# EAGLE board MagicShifter (EAGLE 5.11)
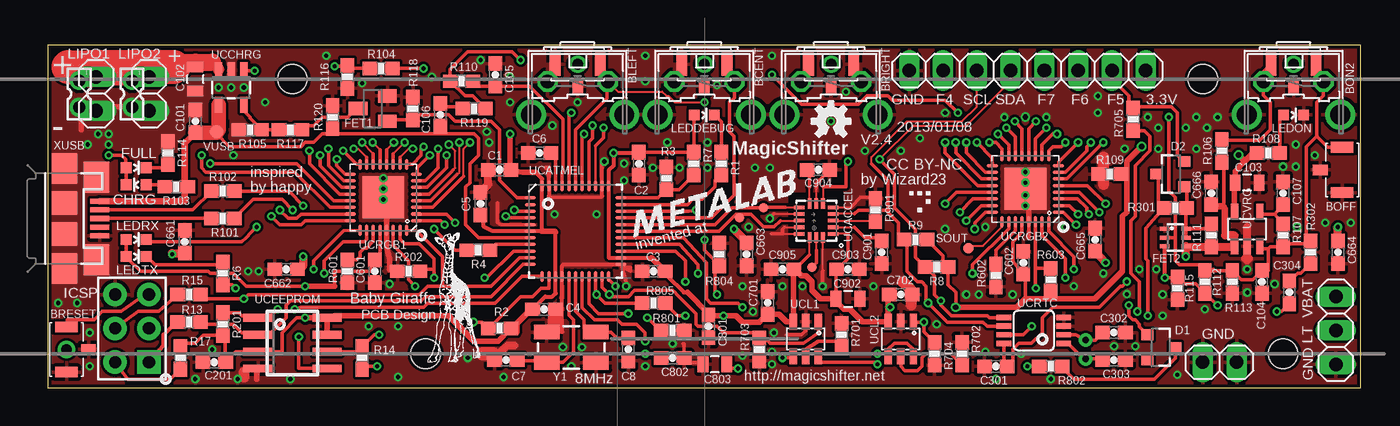
[diagram p1: board, top side]
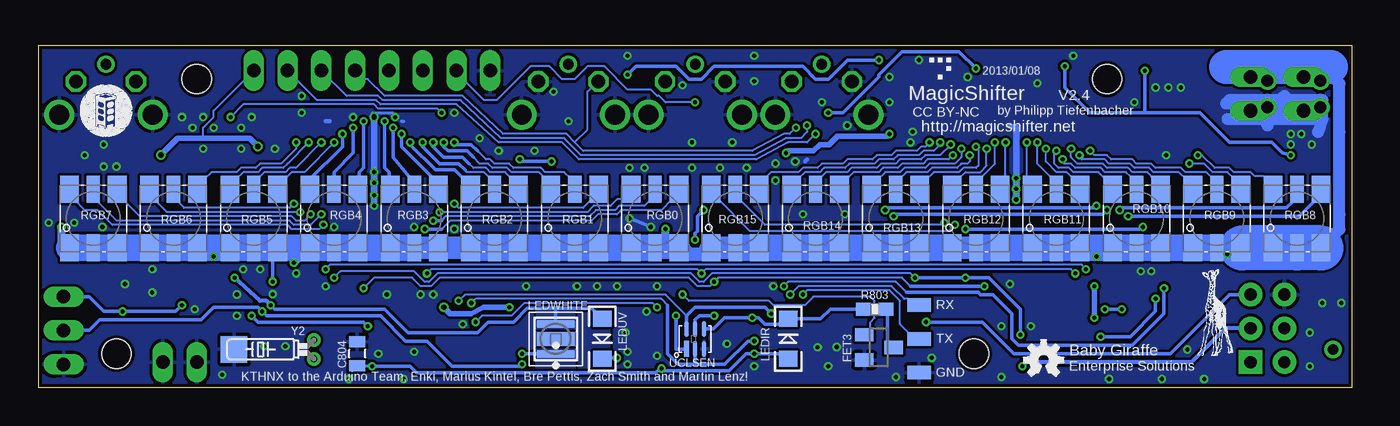
[diagram p2: board, bottom side, seen from below]

Size 98.72 x 25.7 mm. Coordinates in mm from the lower left corner, seen from the top.
Outline: 0,0 98.72,0 98.72,25.7 0,25.7 0,0
Copper layers (1*16): Top 0.035mm / dielectric 1.5mm / Bottom 0.035mm
Design rules "Fusion_eagle_rule_v1.1 *": minimum track width 6mil, minimum drill 12mil, track to track 6mil, track to pad 6mil, pad to pad 6mil, via to via 6mil, smd to smd 0mil, copper to edge 10mil, drill to drill 10mil, minimum pad ring 10mil, minimum via ring 6mil, stop-mask expansion 2mil, vias tented up to drill 100mil, thermal gap 10mil
Net classes: 0 default: width 0.152 mm
Holes 2.2 mm at 92.87,2.54 86.84,23.18 18.41,23.18 28.42,2.54
tRestrict: area 55.9,10.6 to 59.7,14.4

## Footprints (pad centres in the part's own frame; a part is rotated, then mirrored left to right if it is on the bottom)
B3F-31XX = drill 1.016 octagon: 1 -2.261,-1.245; 2 2.261,-1.245 | drill 1.499 pad 2.159 round: 3 -3.505,1.245; 4 3.505,1.245
B3U-1100P-B = smd 0.8 x 1.7: P$1 -1.7,0; P$2 1.7,0 | smd 0.8 x 1.1: P$3 0,-1.65 | drill 0.8 round: P$4 0,0
B3U-1100P = smd 0.8 x 1.7: P$1 -1.7,0; P$2 1.7,0 | smd 0.8 x 1.1: P$3 0,-1.65
0603-CAP = smd 1.1 x 1: 1 -0.85,0; 2 0.85,0
0805 = smd 0.8 x 1.2: 1 -0.9,0; 2 0.9,0
LED-0603 = smd 0.8 x 0.8: A 0,-0.75; C 0,0.75
SOT23-3 = smd 0.8 x 0.9: 1 -0.95,-1; 2 0.95,-1; 3 0,1.1
SOT23 = smd 1 x 1.4: 1 -0.95,-1.1; 2 0.95,-1.1; 3 0,1.1
SOT363_INFINEON = smd 0.3 x 0.7: 1 -0.65,-0.8; 2 0,-0.8; 3 0.65,-0.8; 4 0.65,0.8; 5 0,0.8; 6 -0.65,0.8
HEAD3X2 = drill 0.914 pad 1.778 square: 1 0,0 | drill 0.914 pad 1.778 round: 2 0,2.54; 3 2.54,0; 4 2.54,2.54; 5 5.08,0; 6 5.08,2.54
TP07R = smd 0.7 x 0.7: TP 0,0
1X02 = drill 1.016 long: 1 -1.27,0; 2 1.27,0
1X03 = drill 1.016 long: 1 -2.54,0; 2 0,0; 3 2.54,0
1X08 = drill 1.016 long: 1 -8.89,0; 2 -6.35,0; 3 -3.81,0; 4 -1.27,0; 5 1.27,0; 6 3.81,0; 7 6.35,0; 8 8.89,0
1X03SMD/90 = smd 1.016 x 1.778: 1 -2.54,0; 2 0,0; 3 2.54,0
LED-1206 = smd 1.2 x 1.4: A -1.5,0; C 1.5,0
OSLON = smd 2.8 x 0.55: A 0,1.125; K 0,-1.125 | smd 2.8 x 1: TP 0,0
0603-RES = smd 1.1 x 1: 1 -0.85,0; 2 0.85,0
LED-TRICOLOR-5050 = smd 2 x 1.4: 1 -2.2,1.8; 3 -2.2,-1.8; 4 2.2,-1.8; 6 2.2,1.8 | smd 2 x 1: 2 -2.2,0; 5 2.2,0
TP08R = smd 0.8 x 0.8: TP 0,0
QFN-16_0.5MM = smd 0.8 x 0.27: 1 -1.275,1; 2 -1.275,0.5; 3 -1.275,0; 4 -1.275,-0.5; 5 -1.275,-1; 9 1.275,-1; 10 1.275,-0.5; 11 1.275,0; 12 1.275,0.5; 13 1.275,1 | smd 0.27 x 0.8: 6 -0.5,-1.275; 7 0,-1.275; 8 0.5,-1.275; 14 0.5,1.275; 15 0,1.275; 16 -0.5,1.275
QFN-44-NOPAD = smd 0.82 x 0.27: 1 -3.4,2.5; 2 -3.4,2; 3 -3.4,1.5; 4 -3.4,1; 5 -3.4,0.5; 6 -3.4,0; 7 -3.4,-0.5; 8 -3.4,-1; 9 -3.4,-1.5; 10 -3.4,-2; 11 -3.4,-2.5; 23 3.4,-2.5; 24 3.4,-2; 25 3.4,-1.5; 26 3.4,-1; 27 3.4,-0.5; 28 3.4,0; 29 3.4,0.5; 30 3.4,1; 31 3.4,1.5; 32 3.4,2; 33 3.4,2.5 | smd 0.27 x 0.82: 12 -2.5,-3.4; 13 -2,-3.4; 14 -1.5,-3.4; 15 -1,-3.4; 16 -0.5,-3.4; 17 0,-3.4; 18 0.5,-3.4; 19 1,-3.4; 20 1.5,-3.4; 21 2,-3.4; 22 2.5,-3.4; 34 2.5,3.4; 35 2,3.4; 36 1.5,3.4; 37 1,3.4; 38 0.5,3.4; 39 0,3.4; 40 -0.5,3.4; 41 -1,3.4; 42 -1.5,3.4; 43 -2,3.4; 44 -2.5,3.4
SOT23-5 = smd 0.55 x 1.2: 1 -0.95,-1.3; 2 0,-1.3; 3 0.95,-1.3; 4 0.95,1.3; 5 -0.95,1.3
SO-08 = smd 0.6 x 2.2: 1 -1.905,-2.6; 2 -0.635,-2.6; 3 0.635,-2.6; 4 1.905,-2.6; 5 1.905,2.6; 6 0.635,2.6; 7 -0.635,2.6; 8 -1.905,2.6
SOT23-6 = smd 0.55 x 1.2: 1 -0.95,-1.3; 2 0,-1.3; 3 0.95,-1.3; 4 0.95,1.3; 5 0,1.3; 6 -0.95,1.3
TCS377X = smd 1.2 x 0.35: P$1 -0.75,0.65; P$2 -0.75,0; P$3 -0.75,-0.65; P$4 0.75,-0.65; P$5 0.75,0; P$6 0.75,0.65
QFN32_VSTOP = smd 0.27 x 0.85: 1 -1.75,-2.475; 2 -1.25,-2.475; 3 -0.75,-2.475; 4 -0.25,-2.475; 5 0.25,-2.475; 6 0.75,-2.475; 7 1.25,-2.475; 8 1.75,-2.475; 17 1.75,2.475; 18 1.25,2.475; 19 0.75,2.475; 20 0.25,2.475; 21 -0.25,2.475; 22 -0.75,2.475; 23 -1.25,2.475; 24 -1.75,2.475 | smd 0.85 x 0.27: 9 2.475,-1.75; 10 2.475,-1.25; 11 2.475,-0.75; 12 2.475,-0.25; 13 2.475,0.25; 14 2.475,0.75; 15 2.475,1.25; 16 2.475,1.75; 25 -2.475,1.75; 26 -2.475,1.25; 27 -2.475,0.75; 28 -2.475,0.25; 29 -2.475,-0.25; 30 -2.475,-0.75; 31 -2.475,-1.25; 32 -2.475,-1.75 | smd 3.15 x 3.15: EP 0,0
MSOP8 = smd 0.4 x 1.1: 1 -0.975,-2.25; 2 -0.325,-2.25; 3 0.325,-2.25; 4 0.975,-2.25; 5 0.975,2.25; 6 0.325,2.25; 7 -0.325,2.25; 8 -0.975,2.25
SOT25 = smd 0.55 x 1.2: 1 -0.95,-1.3; 2 0,-1.3; 3 0.95,-1.3; 4 0.95,1.3; 5 -0.95,1.3
TP10R = smd 1 x 1: TP 0,0
87758-0216 = drill 0.9 pad 1.27 round: 1 0,-1; 2 0,1
USB-MICROB = smd 0.38 x 1.4: D+ 0,2.65; D- -0.65,2.65; GND 1.3,2.65; ID 0.65,2.65; VBUS -1.3,2.65 | smd 2.3 x 1.9: MT1 -3.75,0; MT2 3.75,0; MT5 -3.1,2.4; MT6 3.1,2.4 | smd 1.775 x 1.9: MT3 -1.163,0; MT4 1.163,0
CRYSTAL-SMD-5X3 = smd 1.9 x 1.1: 1 -1.85,-1.15; 2 1.85,-1.15; 3 1.85,1.15; 4 -1.85,1.15
NC15LF = drill 0.5 round: 1 -0.7,-1.5; 2 0.7,-1.5 | smd 2 x 2: GND 0,4.5

## Placement (x,y rotation side)
BCENT  BUTTON  [B3F-31XX]  49.37,21.75 180 top
BCENT2  B3UBOSS  [B3U-1100P-B]  49.37,24.29 0 top
BLEFT  BUTTON  [B3F-31XX]  39.85,21.75 180 top
BLEFT2  B3UBOSS  [B3U-1100P-B]  39.85,24.29 0 top
BOFF  OFF  [B3U-1100P]  97.31,16.35 270 top
BON  BUTTON  [B3F-31XX]  93.66,21.75 180 top
BON2  ON  [B3U-1100P-B]  93.66,24.29 0 top
BRESET  B3UBOSS  [B3U-1100P-B]  1.43,2.86 90 top
BRIGHT  BUTTON  [B3F-31XX]  58.9,21.75 180 top
BRIGHT2  B3UBOSS  [B3U-1100P-B]  58.9,24.29 0 top
C1  0.1uF  [0603-CAP]  33.97,16.35 180 top
C2  0.1uF  [0603-CAP]  44.45,16.83 270 top
C3  0.1uF  [0603-CAP]  45.56,8.73 0 top
C4  0.1uF  [0603-CAP]  37.31,5.87 180 top
C5  1uF  [0603-CAP]  32.54,13.81 270 top
C6  1uF  [0603-CAP]  36.99,17.62 0 top
C7  22pF  [0603-CAP]  34.45,2.06 180 top
C8  22pF  [0603-CAP]  43.66,2.86 270 top
C101  1uF  [0603-CAP]  11.11,20 270 top
C102  2.2uF  [0805]  11.11,23.18 90 top
C103  2.2uF/10V/X7R  [0805]  90.17,15.4 180 top
C104  10n  [0603-CAP]  91.28,7.94 90 top
C105  10n  [0603-CAP]  33.66,23.5 270 top
C106  33n oder 47n  [0603-CAP]  29.53,20.48 90 top
C107  NF  [0603-CAP]  92.87,14.61 270 top
C201  0.1uF  [0603-CAP]  12.54,1.91 0 top
C301  0.1uF  [0603-CAP]  71.28,1.59 180 top
C302  NF  [0603-CAP]  80.17,4.13 0 top
C303  NF  [0603-CAP]  80.17,2.06 0 top
C304  33n oder 47n  [0603-CAP]  93.34,7.14 90 top
C601  0.1uF  [0603-CAP]  24.61,8.73 90 top
C602  0.1uF  [0603-CAP]  73.34,9.37 270 top
C661  1uF  [0603-CAP]  10.32,10.95 90 top
C662  1uF  [0603-CAP]  17.94,8.89 180 top
C663  1uF  [0603-CAP]  52.55,10 270 top
C664  1uF  [0603-CAP]  97,10.16 270 top
C665  1uF  [0603-CAP]  78.74,11.11 90 top
C666  1uF  [0603-CAP]  87.47,14.61 90 top
C701  1uF  [0603-CAP]  54.13,6.35 90 top
C702  1uF  [0603-CAP]  64.14,6.99 0 top
C801  1uF  [0603-CAP]  49.69,4.6 270 top
C802  1uF  [0603-CAP]  46.99,2.22 0 top
C803  22uF  [0805]  50.16,1.75 180 top
C804  NF  [0805]  74.77,2.54 90 bottom
C901  0.1uF  [0603-CAP]  62.71,10.16 270 top
C902  4.7uF  [0805]  60.17,6.67 0 top
C903  0.1uF  [0603-CAP]  60.17,8.89 0 top
C904  0.1uF  [0603-CAP]  57.94,16.35 0 top
C905  0.1uF  [0603-CAP]  55.25,8.89 0 top
CHRG  Blue  [LED-0603]  6.67,15.24 90 top
D1  [SOT23-3]  83.66,3.02 270 top
D2  [SOT23-3]  84.45,16.03 90 top
FET1  BSS123  [SOT23]  24.45,20.95 90 top
FET2  NX3008CBKS  [SOT363_INFINEON]  84.77,11.27 270 top
FET3  BSS123  [SOT23]  35.56,3.02 270 bottom
FULL  Green  [LED-0603]  6.67,16.51 270 top
ICSP  HEAD3X2  [HEAD3X2]  7.62,1.91 90 top
INT1  TPTP07R  [TP07R]  52,12.75 0 top
INT2  TPTP07R  [TP07R]  53.82,13.49 0 top
JP_GND  [1X02]  88.11,1.91 180 top
JP_LTEST  [1X03]  96.84,4.29 270 top
JP_PINS  [1X08]  73.66,23.81 180 top
JP_SERIAL  [1X03SMD/90]  32.54,3.65 270 bottom
LEDDEBUG  Blue  [LED-0603]  49.37,20.48 270 top
LEDIR  IR  [LED-1206]  42.39,3.65 90 bottom
LEDON  Red  [LED-0603]  93.66,20.48 270 top
LEDRX  Green  [LED-0603]  6.67,11.11 270 top
LEDTX  Red  [LED-0603]  6.67,9.84 270 top
LEDUV  UV  [LED-1206]  56.36,3.65 270 bottom
LEDWHITE  OSLON  [OSLON]  59.85,3.65 0 bottom
LIPO1  [1X02]  3.65,22.07 270 top
LIPO2  [1X02]  7.62,22.07 270 top
R1  1K  [0603-RES]  50.64,16.83 270 top
R2  10K  [0603-RES]  33.97,4.44 0 top
R3  10K  [0603-RES]  46.51,15.72 270 top
R4  1K  [0603-RES]  32.38,10.32 0 top
R6  1K  [0603-RES]  13.18,8.57 270 top
R7  NF  [0603-RES]  48.58,16.83 270 top
R8  4.7K  [0603-RES]  66.83,9.05 0 top
R9  4.7K  [0603-RES]  65.25,11.11 0 top
R13  330R  [0603-RES]  10.64,4.92 180 top
R14  330R  [0603-RES]  23.65,2.22 270 top
R15  330R  [0603-RES]  10.64,6.98 180 top
R17  NF  [0603-RES]  10,2.22 270 top
R101  22R  [0603-RES]  13.18,12.7 180 top
R102  22R  [0603-RES]  13.18,14.76 180 top
R103  1K  [0603-RES]  9.68,15.08 180 top
R104  47K  [0603-RES]  25.08,23.97 180 top
R105  4.7K  [0603-RES]  15.24,19.37 180 top
R106  10K  [0603-RES]  88.27,17.78 270 top
R107  22K  [0603-RES]  92.87,11.43 90 top
R108  1K  [0603-RES]  91.76,17.62 180 top
R109  NF  [0603-RES]  79.85,16.03 180 top
R110  22K  [0603-RES]  31.11,23.02 0 top
R111  100K  [0603-RES]  87.47,11.43 90 top
R112  330K  [0603-RES]  87,7.94 90 top
R113  560K  [0603-RES]  89.06,7.94 90 top
R114  1K  [0603-RES]  9.05,17.62 90 top
R115  NF  [0603-RES]  84.93,7.46 270 top
R116  100K  [0603-RES]  22.54,23.34 270 top
R117  RTCHRG  [0603-RES]  18.26,19.37 180 top
R118  100k  [0603-RES]  27.46,20.95 270 top
R119  1K  [0603-RES]  32.07,20.95 0 top
R120  100K  [0603-RES]  21.43,20.32 270 top
R201  100K  [0603-RES]  13.18,4.76 270 top
R202  100K  [0603-RES]  27.15,8.73 0 top
R301  NF  [0603-RES]  84.77,13.49 180 top
R302  1K  [0603-RES]  94.93,10.16 90 top
R601  REF1  [0603-RES]  22.54,8.73 90 top
R602  REF2  [0603-RES]  71.28,8.41 90 top
R603  100K  [0603-RES]  75.41,8.1 270 top
R701  REFUV  [0603-RES]  59.69,3.97 270 top
R702  REFWHITE  [0603-RES]  68.74,2.54 270 top
R703  10K  [0603-RES]  53.5,2.86 270 top
R704  10K  [0603-RES]  66.67,2.54 270 top
R705  10K  [0603-RES]  81.6,20.16 90 top
R801  1M  [0603-RES]  46.99,4.29 180 top
R802  22R  [0603-RES]  75.41,1.59 0 top
R803  47R 100mW  [0603-RES]  35.88,5.87 180 bottom
R804  100k  [0603-RES]  50.48,10 270 top
R805  1K  [0603-RES]  45.56,6.35 0 top
R901  0R  [0603-RES]  62.23,13.34 270 top
RGB0  LED-TRICOLOR-5050  [LED-TRICOLOR-5050]  52.39,12.7 90 bottom
RGB1  LED-TRICOLOR-5050  [LED-TRICOLOR-5050]  58.42,12.7 90 bottom
RGB2  LED-TRICOLOR-5050  [LED-TRICOLOR-5050]  64.45,12.7 90 bottom
RGB3  LED-TRICOLOR-5050  [LED-TRICOLOR-5050]  70.48,12.7 90 bottom
RGB4  LED-TRICOLOR-5050  [LED-TRICOLOR-5050]  76.52,12.7 90 bottom
RGB5  LED-TRICOLOR-5050  [LED-TRICOLOR-5050]  82.55,12.7 90 bottom
RGB6  LED-TRICOLOR-5050  [LED-TRICOLOR-5050]  88.58,12.7 90 bottom
RGB7  LED-TRICOLOR-5050  [LED-TRICOLOR-5050]  94.61,12.7 90 bottom
RGB8  LED-TRICOLOR-5050  [LED-TRICOLOR-5050]  4.13,12.7 90 bottom
RGB9  LED-TRICOLOR-5050  [LED-TRICOLOR-5050]  10.16,12.7 90 bottom
RGB10  LED-TRICOLOR-5050  [LED-TRICOLOR-5050]  16.19,12.7 90 bottom
RGB11  LED-TRICOLOR-5050  [LED-TRICOLOR-5050]  22.23,12.7 90 bottom
RGB12  LED-TRICOLOR-5050  [LED-TRICOLOR-5050]  28.26,12.7 90 bottom
RGB13  LED-TRICOLOR-5050  [LED-TRICOLOR-5050]  34.29,12.7 90 bottom
RGB14  LED-TRICOLOR-5050  [LED-TRICOLOR-5050]  40.32,12.7 90 bottom
RGB15  LED-TRICOLOR-5050  [LED-TRICOLOR-5050]  46.35,12.7 90 bottom
SOUT  TPTP08R  [TP08R]  69.22,10.48 0 top
TNC  TPTP07R  [TP07R]  57.47,9.05 0 top
U$1  OSHW-LOGOS  [OSHW-LOGO-S]  23.18,2.06 0 bottom
U$2  METALAB  [METALAB]  43.5,10.95 0 top
U$3  OSHW-LOGOS  [OSHW-LOGO-S]  58.9,20 0 top
U$4  [BABY_GIRAFFE_1.5]  28.57,1.91 0 top
U$5  [BABY_GIRAFFE]  11.59,2.38 0 bottom
U$6  [METALAB_SMALL]  93.66,20.8 0 bottom
UCACCEL  FXOS8700CQ  [QFN-16_0.5MM]  57.78,12.54 180 top
UCATMEL  ATMEGA32U4QFN2  [QFN-44-NOPAD]  39.69,11.75 0 top
UCCHRG  MCP73831  [SOT23-5]  13.81,22.54 180 top
UCEEPROM  25AA080SN  [SO-08]  18.41,3.33 270 top
UCL1  AHK3292  [SOT23-6]  56.99,3.65 180 top
UCL2  AHK3292  [SOT23-6]  64.14,3.65 180 top
UCLSEN  TCS377X  [TCS377X]  49.37,3.65 90 bottom
UCRGB1  TLC5947  [QFN32_VSTOP]  25.24,14.29 90 top
UCRGB2  TLC5947  [QFN32_VSTOP]  73.5,14.92 90 top
UCRTC  MCP7941XMSOP8  [MSOP8]  74.14,4.29 90 top
UCVRG  MCP182433  [SOT25]  90.17,11.91 0 top
VUSB  TPTP10R  [TP10R]  12.7,19.21 90 top
X2  87758-0216  [87758-0216]  6.35,22.07 180 top
X3  87758-0216  [87758-0216]  2.38,22.07 180 top
XUSB  USB-MICROB  [USB-MICROB]  1.27,12.7 270 top
Y1  8MHz  [CRYSTAL-SMD-5X3]  39.37,3.02 0 top
Y2  [NC15LF]  79.53,2.86 90 bottom

## Tracks (layer width: path | path; a pad name or v marks a point on that pad's centre or on a via)
+3V3  (via drill 0.31, 0.4)
  Top 0.16: R17.2 R17.1 | 60.17,11.54 UCACCEL.1 | 57.28,9.98 UCACCEL.14
  Top 0.254: 24.99,9.53 24.99,9.2 24.75,9.2 | 24.99,9.53 UCRGB1.28 | 32.78,12.09 32.85,12.09 | 21.59,7.62 21.59,8.73 24.29,8.73 24.29,9.58 C601.2 24.93,9.58 24.99,9.53 | 37.15,11.75 37.19,11.79 | 42.19,9.79 42.23,9.75 | UCRGB2.28 73.25,11.66 72.55,10.95 72.55,9.47 C602.2 | R17.2 9.84,1.27 9.21,0.64 6.03,0.64 ICSP.2 | R17.1 10.1,3.33 11.11,3.33 11.69,3.91 R201.2 13.34,3.81 13.34,2.12 13.49,1.96 C201.2 13.07,2.22 13.65,2.22 14.13,2.7 UCEEPROM.3 17.62,2.7 17.62,4.13 18.73,5.24 v19.37,5.24 | C602.2 73.47,8.68 73.44,8.65 | LEDRX.A LEDTX.A 5.92,9.8 6.99,8.73 12.06,8.73 12.22,8.57 13.97,8.57 14.92,7.62 v19.37,7.62 | 60.17,11.54 60.17,9.68 59.37,8.89 C903.1 59.27,8.84 C902.1 | C103.2 89.22,15.19 | UCL1.3 56.07,5.08 | C902.1 59.11,7.14 | 63.19,6.73 C702.1 | C902.1 59.27,6.46 | 46.51,8.41 C3.2 46.57,8.41 | 63.19,6.03 v63.34,6.02 | 44.39,17.62 C2.1 R7.1 48.58,20.43 LEDDEBUG.A | 54.03,5.4 C701.1 | 56.2,8.89 57.28,9.98 | 55.78,8.89 C905.2 56.2,8.89 | 56.2,8.89 | v68.26,6.03 68.26,7.14 67.68,7.72 R8.2 67.68,9.15 67.31,9.21 67.31,9.9 R9.2 | C602.2 73.34,8.57 73.5,8.41 73.5,6.67 | R603.2 75.41,6.67 75.09,6.67
  Top 0.305: 37.15,11.75 UCATMEL.6 33.44,11.75 32.78,12.09 32.78,13.36 C5.2 | 42.23,9.75 UCATMEL.24 45.4,9.75 | 38.19,11.66 UCATMEL.14 38.19,7.07 37.94,6.83 37.41,6.83 C4.2 36.35,5.87 | 37.19,11.79 UCATMEL.44 37.19,15.68 36.67,16.19 | 42.19,9.79 UCATMEL.34 42.19,16.31 42.55,16.67 v42.55,17.62 44.39,17.62 | 48.1,7.14 47.84,7.14 46.57,8.41
  Top 0.406: 37.15,11.75 38.1,11.75 38.19,11.66 | v19.37,7.62 21.59,7.62 | v19.37,5.24 UCEEPROM.8 | UCEEPROM.8 21.59,5.24 21.43,5.24 | 34.82,16.3 34.82,16.25 34.77,16.35 v34.77,19.05 | 36.67,16.19 35.72,16.19 34.82,16.3 | 34.82,16.3 C1.1 | UCEEPROM.8 UCEEPROM.7 | 21.43,5.24 | 21.43,5.24 21.59,5.4 28.26,5.4 28.42,5.4 28.73,5.4 30.16,5.4 32.07,3.49 33.87,3.49 R2.2 35.24,4.13 35.3,4.18 35.3,4.82 36.35,5.87 | 89.22,15.19 UCVRG.5 | 63.19,6.73 63.19,6.03 UCL2.3 61.25,4.95 60.33,5.87 59.85,5.87 59.27,6.46 | 45.4,9.75 C3.2 | v68.26,6.03 71.75,6.03 72.87,6.03 73.5,6.67 | 73.5,6.67 73.34,6.51 | 73.5,6.67 75.09,6.67 78.74,6.67 80.8,8.73 80.8,12.86 81.12,13.18 81.12,15.88 | 54.03,5.4 53.66,5.08 53.5,4.92 52.23,4.92 51.75,5.4 v50.8,5.4 49.69,5.4 C801.1 49.69,5.56 48.1,7.14 | 56.2,8.89 56.67,8.41 56.99,8.41 57.47,7.94 57.47,7.3 58.1,6.67 C902.1 | C701.1 54.98,5.5 55.53,4.95 UCL1.3 | 56.07,5.08 56.07,8.87 C905.2 | v89.53,17.46 90.01,16.99 | 90.91,17.57 R108.2 90.65,17.62 90.01,16.99 | C103.2 89.27,16.25 90.01,16.99 | 90.01,16.99 | 81.12,15.88 81.12,16.99 v82.23,18.1 | R109.1 80.86,15.88 81.12,15.88
  Bottom 0.16: JP_PINS.1 | JP_PINS.1 85.57,20.8 85.57,20.32 86.36,19.53 86.36,18.73
  Bottom 0.254: UCLSEN.P$1 50.06,2.86 50.8,2.86 v50.8,5.4
  Bottom 0.406: v19.37,5.24 v19.37,7.62 | v34.77,19.05 34.92,18.89 38.68,18.89 39.31,18.26 40.01,18.26 40.48,17.78 42.39,17.78 v42.55,17.62 | v82.23,18.1 82.87,18.73 86.36,18.73 88.27,18.73 v89.53,17.46 | v68.26,6.03 67.79,5.56 66.2,5.56 65.26,6.02 v63.34,6.02
A1  (via drill 0.31)
  Top 0.254: UCATMEL.37 40.69,18.46 40.96,18.73 v40.96,19.68
  Bottom 0.16: JP_PINS.3 75.56,21.91 73.18,21.91 72.87,21.59 66.99,21.59 63.98,18.73 59.21,18.73 57.94,17.46 44.93,17.46 42.55,18.73 41.43,18.73 40.96,19.21 v40.96,19.68
AREF
  Top 0.254: UCATMEL.42 38.19,17.27 C6.2
BLANK  (via drill 0.31, 0.31 pad 0.3)
  Top 0.254: v27.62,7.62 27.15,8.1 27.15,9.53 25.99,10.68 UCRGB1.30 | v47.94,7.94 47.94,9.53 47.22,10.25 UCATMEL.25 | 74.25,8.89 74.25,7.5 v74.3,7.46 | 74.25,8.89 UCRGB2.30 | R603.1 74.31,8.95 74.25,8.89
  Bottom 0.16: v74.3,7.46 73.5,8.26 70.64,8.26 70.01,7.62 69.22,7.62 68.58,8.26 49.85,8.26 49.21,7.62 48.26,7.62 v47.94,7.94 47.62,8.26 33.81,8.26 33.18,7.62
  Bottom 0.254: v27.62,7.62 33.18,7.62
BTNC
  Top 0.254: BCENT2.P$2 51.39,23.55 BCENT.1 51.63,21.79 51.28,21.43 51.28,19.21 51.59,18.89 51.59,14.45 49.9,12.75 UCATMEL.30
BTNL  (via drill 0.31)
  Top 0.16: BLEFT.1 42.88,22.23 46.2,22.23 46.51,21.91 46.67,21.91 47.15,21.43 v49.37,21.43
  Top 0.254: BLEFT2.P$2 41.86,23.55 BLEFT.1 42.07,22.95 42.07,21.75 39.69,19.37 UCATMEL.39
  Bottom 0.16: v49.37,21.43 51.59,21.43 52.07,21.91 52.23,21.91 52.7,22.38 54.45,22.38 56.2,24.13 57.47,24.13 58.42,23.18 59.37,23.18 60.33,24.13 61.75,24.13 64.29,21.59 65.25,21.59 67.31,23.65 JP_PINS.7
BTNR  (via drill 0.31)
  Top 0.2: UCATMEL.36 41.19,18.17
  Top 0.254: BRIGHT2.P$1 56.88,23.55 BRIGHT.2 | 41.19,18.17 | v41.8,19.53 41.8,18.78 41.19,18.17
  Bottom 0.16: 58.42,18.41 57.78,17.78 45.09,17.78 42.7,19.05 42.28,19.05 v41.8,19.53 | 58.42,18.41 59.05,19.05 63.82,19.05 66.83,21.91 72.71,21.91 73.98,23.18 74.3,23.18 JP_PINS.4 | BRIGHT.2 56.7,22.99 57.47,22.23 57.47,19.37 58.42,18.41
CS_EEPROM  (via drill 0.31)
  Top 0.254: v17.3,5.87 16.67,5.24 UCEEPROM.1 15.5,5.4 14.61,5.4 14.39,5.61 R201.1 | v18.57,5.87 19.05,6.03 28.26,6.03 28.57,6.35 33.66,6.35 33.81,6.51 35.65,8.35 UCATMEL.12
  Bottom 0.254: v17.3,5.87 v18.57,5.87
D+  (via drill 0.31)
  Top 0.254: UCATMEL.4 34.56,12.75 v34.45,12.86 | 17.62,14.13 | 17.62,14.13 v18.41,13.34 | R101.1 15.46,14.13 17.62,14.13
  Bottom 0.254: v34.45,12.86 34.29,13.02 18.73,13.02 v18.41,13.34
D-  (via drill 0.31)
  Top 0.254: UCATMEL.3 35.17,13.25 v35.08,13.34 | R102.1 18.15,14.76 v19.21,13.65
  Bottom 0.254: v35.08,13.34 34.92,13.49 19.37,13.49 v19.21,13.65
DEBUG_LED
  Top 0.254: UCATMEL.32 48.11,13.75 48.49,14.13 49.21,14.13 50.16,15.08 50.16,15.56 50.64,15.96 R1.2
GND  (via drill 0.31, 0.31 pad 0.3, 0.4 pad 0.3)
  Top 0.16: 54.59,13.04 UCACCEL.10 | 58.28,8.76 UCACCEL.16 | 55.24,11.54 UCACCEL.13 | 55.38,12.04 UCACCEL.12 | UCACCEL.7 57.78,15.03 | UCACCEL.5 60.37,13.54
  Top 0.254: 38.69,9.16 38.77,9.25 | 38.69,4.18 C4.1 38.1,5.87 | UCATMEL.5 34.11,12.25 33.81,12.38 33.81,13.87 | 41.69,14.38 41.59,14.29 37.78,14.29 | BLEFT.2 BLEFT2.P$1 | UCRGB2.29 73.75,11.26 | 47.78,3.28 47.84,3.28 C802.2 | v54.29,12.7 54.59,13.04 | 58.28,8.76 58.26,8.73 v58.26,7.62 | 54.4,11.54 55.24,11.54 55.24,11.91 55.38,12.04 | 55.56,3.97 56.67,3.97 56.99,4.29 | 60.37,13.54 61.12,14.29 62.13,14.29 R901.1 | 57.78,15.03 57.78,15.34 C904.2 | 43.5,7.94 | 43.18,9.05 43.5,7.94 | 43.18,9.05 43.81,9.05 43.81,8.73 43.18,9.05 | v14.29,0.64 14.61,0.64 14.76,0.79
  Top 0.305: 38.77,9.25 UCATMEL.23 | 38.69,9.16 UCATMEL.15 38.69,4.18 | 41.69,14.38 UCATMEL.35 41.69,17.05 41.91,17.14 | 37.78,14.29 37.69,14.38 UCATMEL.43 37.69,16.51 | 56.99,4.29 56.99,5.08 | 47.78,2.22 47.78,2.06 47.94,1.91 49.21,1.91
  Top 0.35: 37.69,16.51 37.47,16.51
  Top 0.406: 25.72,8.83 25.72,9.68 25.49,10.54 UCRGB1.29 25.49,14.36 | UCRGB2.29 73.75,14.51 73.5,13.49 | 8.73,21.11 2.22,21.11 2.54,20.8 2.54,19.37 | 15.72,0.64 15.72,1.27
  Top 0.5: 25.49,14.36 25.24,15.4
  Top 0.61: 90.17,12.06 UCVRG.2 90.17,9.84 | C5.1 33.12,15.24 C1.2 | 90.17,9.84 90.17,9.53 | 90.17,9.84 90.01,9.68 90.33,9.68 | 35.08,3.17 34.61,3.17 33.5,2.22 33.5,2.54
  Top 0.813: 64.29,7.94 64.93,7.3 64.93,6.19 | 79.38,17.3 79.38,15.24 | 14.76,0.79 14.76,1.11 | 38.1,4.31
  Top 1: 38.1,4.31 38.1,5.87
  Top 1.016: 32.7,2.54 33.5,2.54
  Bottom 0.24: 72.07,20.6 73.66,20.6
  Bottom 0.254: v52.7,12.06 v54.29,12.7 | 71.28,20 71.44,20
  Bottom 0.305: 40.96,17.14 41.12,16.99
  Bottom 0.35: 76.83,20 77.15,20
  Bottom 0.406: 25.24,19.53 25.72,19.68
  Bottom 0.5: v25.24,14.13 25.24,19.53 | v73.5,13.65 v73.5,20.32
  Bottom 0.9: 2.22,20.16 9.37,20.16 | 2.22,20.16 2.22,21.11 | 2.22,20.16 2.54,19.21 | 3.49,21.59 4.76,21.59 5.08,21.91 5.48,21.51 9.45,21.35 | 2.22,20.16 9.45,21.35 | 9.45,21.35 2.22,21.59 9.21,21.59 | 6.35,19.68 6.43,21.19
  other vias: 43.34,16.83 38.73,3.04 39.37,1.59 25.72,7.78 25.24,14.92 73.5,14.45 73.5,15.4 3.17,1.59 15.08,8.73 37.94,19.68 38.1,13.02 41.27,13.02 47.5,16.51 43.34,15.56 93.82,16.6 69.06,6.99 92.87,16.6 53.18,16.51 71.91,20.32 0.79,6.35 11.11,0.64 18.26,0.64 34.29,0.79 40.16,3.02 73.5,16.19 25.24,15.72 14.76,22.54 26.35,4.6 90.17,8.89 43.5,7.62 62.07,7.62 54.45,1.75 83.82,6.98 83.34,8.89 56.75,7.62 52.23,2.38 55.24,7.62 54.61,4.13 52.23,7.62 72.55,6.99 46.99,3.28 45.5,16.51 33.18,18.42 33.02,19.21 61.44,17.78 64.14,17.78 95.25,17.46 93.82,18.26 34.77,21.43 67.47,11.91 85.57,19.53 83.5,19.53 87.15,19.53 93.92,12.07 75.09,20.32 67.47,20.64 82.71,20.32 78.95,21.91 79.38,8.57 76.52,12.07 70.48,12.07 13.81,22.54 32.54,24.61 65.56,18.73 70.01,6.99 70.48,2.7 84.93,0.95 87,5.87 28.89,23.34 2.22,6.35 12.38,2.86 78.95,20.64 86.36,20.32 87.95,20.32 41.85,16.99 44.93,1.59 66.83,4.76 97.95,12.38 31.59,2.22 26.35,0.79 53.02,5.72 54.45,2.7 86.36,17.94 81.12,7.02 83.5,17.94 80.17,3.11 71.28,0.63 44.93,24.92 54.45,24.92 39.85,21.43 49.6,18.42 49.6,16.51 46.58,18.42 54.29,16.51 50.32,22.7 77.15,7.62 75.41,0.63 34.77,23.34 96.04,12.38 58.9,20 60.01,22.23 44.93,23.02 73.18,2.54 80.96,17.94 82.07,8.89 90.17,7.14 3.18,4.13 92.23,7.78 4.6,18.26 4.6,19.05 3.81,19.05 12.86,22.54 23.65,22.86 24.13,4.6 15.87,8.73 13.97,17.46 83.82,5.4 81.76,3.11 16.35,21.43 20.96,24.92 3.02,18.26
  pour Top (isolate 0.2): 0,0 98.42,0 98.42,25.4 0,25.4
  pour Bottom (isolate 0.2, rank 3): 0,0 98.42,0 98.42,25.4 0,25.4
  pour Top (isolate 0.254, no thermals): -2.54,27.94 14.92,27.94 15.56,17.78 -2.54,17.78
HWB
  Top 0.254: UCATMEL.33 45.9,14.25 R3.2 47.47,14.87 R7.2
INT1
  Top 0.16: 55.09,12.54 UCACCEL.11
  Top 0.254: UCATMEL.28 50.48,11.75 51.75,13.02 | 51.75,13.02 52.86,13.02 53.82,12.06 54.61,12.06 55.09,12.54 | 51.75,13.02 51.75,13 INT1.TP
INT2
  Top 0.16: 55.45,13.54 UCACCEL.9
  Top 0.254: UCATMEL.29 50.19,12.25 51.44,13.49 INT2.TP 53.7,13.54 55.45,13.54
INT3  (via drill 0.31)
  Top 0.254: R805.1 41.91,6.35 v41.27,6.99 41.19,7.07 UCATMEL.20
  Bottom 0.16: v41.27,6.99 40.96,7.3 34.77,7.3 33.97,6.51 33.97,4.76 33.18,3.97 32.7,3.65 JP_SERIAL.2
INTRTC  (via drill 0.31)
  Top 0.254: UCATMEL.38 40.19,18.91 v40.32,19.05 | JP_PINS.2 80.01,23.18 81.28,21.91 81.28,21.01 R705.2 81.5,21.11 84.45,21.11 84.93,20.64 84.93,17.46 85.57,16.82 D2.2
  Bottom 0.16: JP_PINS.2 77.79,21.59 73.34,21.59 73.03,21.27 67.31,21.27 64.14,18.41 59.37,18.41 58.1,17.14 44.77,17.14 42.39,18.41 40.96,18.41 v40.32,19.05
LED_ENA  (via drill 0.31)
  Top 0.254: UCL1.1 57.94,4.12 56.83,3.33 54.29,3.33 53.5,4.13 | 53.5,4.13 53.02,4.13 52.7,4.13 52.39,4.13 50.8,4.13 50.32,4.6 48.9,4.6 48.74,4.76 48.74,5.56 47.78,6.51 | 47.78,6.51 47.31,6.99 47.15,7.14 46.99,7.3 44.13,7.3 43.66,6.83 42.39,6.83 v42.23,6.99 41.69,7.53 UCATMEL.21 | 47.78,6.51 | 53.5,4.13 R703.1
  Bottom 0.16: v42.23,6.99 41.59,7.62 34.61,7.62 33.66,6.67 33.34,6.67 32.86,6.19 JP_SERIAL.1
LED_ENB  (via drill 0.31)
  Top 0.254: UCATMEL.27 47.81,11.25 49.53,9.37 49.53,6.67 49.85,6.35 51.91,6.35 v52.23,6.03 | UCL2.1 65.21,4.92 65.56,4.92 65.72,4.92 v65.88,4.92 65.88,4.18 R704.1
  Bottom 0.16: v52.23,6.03 52.55,6.35 62.23,6.35 63.18,5.4 65.41,5.4 v65.88,4.92
MISO
  Top 0.254: UCATMEL.11 35.76,9.25 33.34,6.83 28.42,6.83 28.1,6.51 18.41,6.51 18.26,6.51 17.94,6.19 17.94,5.24 16.67,3.97 UCEEPROM.2 15.5,4.13 14.61,4.13 13.97,4.76 11.33,4.76 R13.1
MOSI  (via drill 0.31)
  Top 0.254: UCATMEL.10 35.47,9.75 33.34,7.62 32.86,7.62 32.23,7.62 28.57,7.62 | 28.57,7.62 27.94,6.99 22.54,6.99 21.91,6.99 15.08,6.99 v14.76,6.67 13.97,6.67 11.59,6.67 11.33,6.99 R15.1 | 28.57,7.62 29.69,7.62 29.69,9.84 27.74,11.79 UCRGB1.32 | UCEEPROM.5 18.89,1.43 v18.89,3.81
  Bottom 0.254: v18.89,3.81 16.67,3.81 14.76,5.71 v14.76,6.67
MOSI_ICSP
  Top 0.254: 9.53,6.99 R15.2 8.36,5.71 6.83,5.71 ICSP.4 | ICSP.4
N$1
  Top 0.254: C7.1 35.35,2.01 37.05,2.01 36.83,1.91 37.72,1.91 Y1.1 37.56,1.91 38.73,1.91 39.53,2.7 39.53,5.08 39.19,5.42 UCATMEL.16
N$2
  Top 0.254: UCATMEL.17 39.69,5.71 40.32,5.08 40.32,4.45 40.64,4.13 41.18,4.13 Y1.3 | 40.96,4.13 41.34,4.13 Y1.3 | Y1.3 42.35,4.17 42.81,3.71 C8.1
N$3
  Top 0.254: CHRG.A 8.52,15.24 R103.2
N$4  (via drill 0.31)
  Top 0.254: R4.1 30.64,10.32 v29.05,11.91 | v15.72,12.06 15.32,11.67 14.92,11.27 14.61,10.95 7.58,10.95 LEDRX.C
  Bottom 0.254: v15.72,12.06 16.03,11.91 v29.05,11.91
N$5
  Top 0.254: R6.1 13.02,9.21 8.1,9.21 7.46,9.84 LEDTX.C
N$6
  Top 0.254: XUSB.D- 10.91,13.35 R102.2
N$7
  Top 0.254: R1.1 50.64,17.78 50.64,19.96 LEDDEBUG.C
N$8
  Top 0.254: XUSB.D+ R101.2
N$9
  Top 0.254: FULL.C 8.79,16.51 R114.1
N$11
  Top 0.254: UCCHRG.5 14.76,20.8 15.24,20.32 15.24,20.22 R105.1 16.25,19.37 R117.2
N$12  (via drill 0.31)
  Top 0.254: UCRGB2.7 76.5,16.17 78.11,17.78 78.11,18.1 v78.42,18.41
  Bottom 0.16: v78.42,18.41 80.01,16.83 | 80.01,16.83 | 80.01,16.83 80.33,16.51 81.92,16.51 82.23,16.19 83.34,16.19 83.98,15.56 83.98,15.27 RGB5.6
  Bottom 0.254: RGB5.6 84.14,15.11
N$13  (via drill 0.31)
  Top 0.254: 26.99,16.51 UCRGB1.9 27.42,16.79 28.1,17.46 28.1,17.94 v28.26,18.1
  Bottom 0.152: v28.26,18.1 28.1,17.94 | 29.53,16.19 31.43,16.19 32.07,15.56 32.07,15.32 RGB13.4
  Bottom 0.16: 28.1,17.94 28.1,16.67 28.26,16.51 29.21,16.51 29.53,16.19
N$14  (via drill 0.31)
  Top 0.254: UCRGB1.8 27.79,16.04 27.79,16.51 v28.73,17.46
  Bottom 0.152: RGB13.5 34.13,15.06 34.13,15.56 33.5,16.19 31.91,16.19 31.59,16.51 29.69,16.51
  Bottom 0.16: v28.73,17.46 28.73,16.99 28.89,16.83 29.37,16.83 29.69,16.51
N$15  (via drill 0.31)
  Top 0.254: UCRGB1.7 28.4,15.54 29.37,16.51 v29.37,17.94
  Bottom 0.152: 29.37,17.3 29.84,16.83 31.75,16.83 32.07,16.51 33.66,16.51 33.97,16.19 35.08,16.19 35.72,15.56 35.72,15.27 RGB13.6
  Bottom 0.16: v29.37,17.94 29.37,17.3
  Bottom 0.254: RGB13.6 36.04,14.95
N$16  (via drill 0.31)
  Top 0.254: UCRGB1.24 19.36,12.54 19.05,12.22 17.46,12.22 v16.83,12.86
  Bottom 0.254: v16.83,12.86 3.97,12.86 2.86,13.97 2.86,14.37 RGB8.4
N$17  (via drill 0.31)
  Top 0.254: UCRGB1.23 19.07,13.04 18.73,12.7 18.1,12.7 v17.46,13.34
  Bottom 0.254: v17.46,13.34 17.3,13.49 4.92,13.49 4.45,13.97 4.45,14.58 RGB8.5
N$18  (via drill 0.31)
  Top 0.254: UCRGB1.22 21.23,13.54 18.57,16.19 11.91,16.19 11.59,16.51 v11.59,17.46
  Bottom 0.16: 6.35,15.32 6.35,15.56 6.67,15.88 7.3,15.88 7.62,16.19 8.89,16.19 9.21,16.51 10.32,16.51 11.27,17.46 v11.59,17.46
  Bottom 0.254: RGB8.6 6.35,15.32
N$19  (via drill 0.31)
  Top 0.254: UCRGB1.6 28.53,15.04 30,16.51 v30,17.46
  Bottom 0.152: RGB14.4 37.94,15.48 37.94,15.72 37.47,16.19 35.56,16.19 35.24,16.51 34.13,16.51 33.81,16.83 32.23,16.83 31.91,17.14 30.32,17.14 v30,17.46 | v30,17.46
  Bottom 0.254: RGB14.4 38.42,15.01
N$20  (via drill 0.31)
  Top 0.16: 30.48,16.35 30.64,16.51 30.64,17.78 v30.16,18.26
  Top 0.254: UCRGB1.5 28.67,14.54 30.32,16.19 30.48,16.35 | 30.48,16.35
  Bottom 0.152: RGB14.5 40.32,15.4 39.53,16.19 37.94,16.19 37.62,16.51 35.72,16.51 35.4,16.83 34.29,16.83 33.97,17.14 32.38,17.14 32.07,17.46 30.96,17.46 v30.16,18.26
N$21  (via drill 0.31)
  Top 0.16: 30.8,16.03 30.96,16.19 v30.96,18.41
  Top 0.254: UCRGB1.4 28.8,14.04 30.8,16.03
  Bottom 0.152: RGB14.6 41.59,15.43 41.59,15.72 41.12,16.19 40.01,16.19 39.69,16.51 38.1,16.51 37.78,16.83 35.88,16.83 35.56,17.14 34.45,17.14 34.13,17.46 32.54,17.46 32.23,17.78 31.43,17.78 30.96,18.26 v30.96,18.41
N$22  (via drill 0.31)
  Top 0.16: v26.04,18.41 25.49,17.87
  Top 0.254: 25.49,17.87 UCRGB1.12
  Bottom 0.16: v26.04,18.41 26.04,15.32 RGB12.4
N$23  (via drill 0.31)
  Top 0.16: v26.83,18.41 25.99,17.58
  Top 0.254: 25.99,17.58 UCRGB1.11
  Bottom 0.16: v26.83,18.41 26.83,16.83 28.1,15.56 28.1,15.06 RGB12.5
N$24  (via drill 0.31)
  Top 0.16: 26.49,17.28 27.15,17.94 v27.46,17.94
  Top 0.254: 26.49,17.28 UCRGB1.10
  Bottom 0.16: RGB12.6 29.53,15.43 29.53,15.72 29.05,16.19 27.94,16.19 27.46,16.67 v27.46,17.94
N$25  (via drill 0.31)
  Top 0.152: 31.27,15.88 31.27,17.94 v31.75,18.41
  Top 0.16: 31.11,15.72 31.27,15.88
  Top 0.254: UCRGB1.3 28.94,13.54 31.11,15.72 | 31.27,15.88
  Bottom 0.152: v31.75,18.41 32.07,18.1 32.38,18.1 32.7,17.78 34.29,17.78 34.61,17.46 35.72,17.46 36.04,17.14 37.94,17.14 38.26,16.83 39.85,16.83 40.16,16.51 41.27,16.51 41.43,16.35
  Bottom 0.16: 41.43,16.35 41.59,16.19 43.66,16.19 44.45,15.4 44.45,15.01 RGB15.4
N$26  (via drill 0.31)
  Top 0.254: UCRGB1.2 29.98,13.04 v30.64,12.38
  Bottom 0.16: v30.64,12.38 30.8,12.22 44.13,12.22 46.04,14.13 46.04,14.58 RGB15.5
N$27  (via drill 0.31)
  Top 0.254: UCRGB1.1 28.42,12.54 29.53,12.54 v29.84,12.22
  Bottom 0.16: v29.84,12.22 30.32,11.75 45.24,11.75 47.78,14.29 47.78,14.53 RGB15.6
  Bottom 0.254: RGB15.6 48.1,14.85
N$28  (via drill 0.31)
  Top 0.254: UCRGB1.21 21.52,14.04 18.73,16.83 v12.22,16.83
  Bottom 0.16: 8.26,14.79 RGB9.4 8.89,15.43 8.89,15.72 9.37,16.19 10.48,16.19 11.11,16.83 v12.22,16.83
  Bottom 0.254: RGB9.4 8.57,15.11
N$29  (via drill 0.31)
  Top 0.254: UCRGB1.20 21.98,14.54 19.68,16.83 v19.68,17.78
  Bottom 0.16: RGB9.5 10.32,15.06 10.32,15.56 10.95,16.19 12.54,16.19 12.86,16.51 14.76,16.51 15.08,16.83 16.19,16.83 16.51,17.14 18.1,17.14 18.41,17.46 19.37,17.46 v19.68,17.78
N$30  (via drill 0.31)
  Top 0.254: UCRGB1.19 22.11,15.04 20.48,16.67 v20.48,17.46
  Bottom 0.16: v20.48,17.46 20.48,17.3 20.32,17.14 18.57,17.14 18.26,16.83 16.67,16.83 16.35,16.51 15.24,16.51 14.92,16.19 13.02,16.19 12.38,15.56 12.38,15.32 RGB9.6
N$31  (via drill 0.31)
  Top 0.254: UCRGB1.18 22.25,15.54 21.11,16.67 v21.11,17.94
  Bottom 0.16: v21.11,17.94 21.11,17.3 20.64,16.83 18.73,16.83 18.41,16.51 16.83,16.51 16.51,16.19 15.4,16.19 15.08,15.88 RGB10.4
N$32  (via drill 0.31)
  Top 0.254: UCRGB1.17 22.7,16.04 22.38,16.04 21.75,16.67 v21.75,17.14
  Bottom 0.16: v21.75,17.14 21.75,16.99 21.59,16.83 21.11,16.83 20.8,16.51 18.89,16.51 18.57,16.19 16.99,16.19 16.67,15.88 RGB10.5
N$33  (via drill 0.31)
  Top 0.254: UCRGB1.16 23.22,16.79 v22.23,17.78
  Bottom 0.16: RGB10.6 18.1,15.01 18.1,15.24 19.05,16.19 20.95,16.19 21.27,16.51 22.07,16.51 22.38,16.83 22.38,17.62 v22.23,17.78
N$34  (via drill 0.31)
  Top 0.16: 23.99,17.28 23.34,17.94 v23.02,17.94
  Top 0.254: 23.99,17.28 UCRGB1.15
  Bottom 0.16: v23.02,17.94 23.02,16.99 22.23,16.19 21.43,16.19 20.43,15.19 RGB11.4
  Bottom 0.254: 20.64,15.56 20.64,15.11 RGB11.4
N$35  (via drill 0.31)
  Top 0.16: v23.65,18.41 24.49,17.58
  Top 0.254: 24.49,17.58 UCRGB1.14
  Bottom 0.16: v23.65,18.41 23.65,16.83 22.23,15.4 RGB11.5
N$36
  Top 0.254: UCRGB1.27 24.49,11 23.97,10.48 23.81,10.48 23.5,10.16 23.5,9.84 23.23,9.58 R601.2
N$37  (via drill 0.31)
  Top 0.16: v24.45,18.41 24.99,17.87
  Top 0.254: 24.99,17.87 UCRGB1.13
  Bottom 0.16: v24.45,18.41 24.45,15.32 RGB11.6
N$38
  Top 0.254: LEDON.A 92.62,20.06 92.61,20.04 R108.1
N$39  (via drill 0.31 pad 0.3)
  Top 0.254: UCRGB2.16 71.75,17.94 71.28,18.41 v70.8,18.41
  Bottom 0.254: v70.8,18.41 70.8,18.26 68.9,16.35 67.47,16.35 66.25,15.13 RGB2.6
N$40  (via drill 0.31 pad 0.3)
  Top 0.254: UCRGB2.18 70.5,16.17 69.06,17.62 v69.06,18.41
  Bottom 0.16: 66.36,16.83 66.04,16.51 65.09,16.51 64.77,16.19 63.66,16.19 62.87,15.4
  Bottom 0.254: v69.06,18.41 69.06,18.1 68.42,17.46 | 68.42,17.46 | 68.42,17.46 68.26,17.3 66.83,17.3 66.36,16.83 | 62.87,15.4 62.87,15.11 RGB2.4
N$41  (via drill 0.31 pad 0.3)
  Top 0.254: UCRGB2.17 71,17.26 v69.85,18.41
  Bottom 0.16: 66.67,16.35 66.52,16.19 65.25,16.19 64.45,15.4
  Bottom 0.254: v69.85,18.41 69.85,18.1 68.58,16.83 67.15,16.83 66.67,16.35 | RGB2.5 64.45,15.4
N$42  (via drill 0.31 pad 0.3)
  Top 0.254: UCRGB2.19 70.21,15.67 68.26,17.62 v68.26,18.41
  Bottom 0.16: 66.04,17.3 65.56,16.83 64.93,16.83 64.61,16.51 63.5,16.51 63.18,16.19 61.12,16.19 60.48,15.56
  Bottom 0.254: v68.26,18.41 68.26,18.1 67.94,17.78 66.52,17.78 66.04,17.3 | 60.48,15.56 60.48,15.16 RGB1.6
N$43  (via drill 0.31 pad 0.3)
  Top 0.254: UCRGB2.21 68.33,14.67 v67.47,13.81
  Bottom 0.16: v67.47,13.81 67.15,13.49 57.78,13.49 56.99,14.29 56.99,14.53 RGB1.4
N$44  (via drill 0.31)
  Top 0.254: UCRGB2.20 69.92,15.17 67.47,17.62 v67.47,18.41
  Bottom 0.16: 65.72,17.78 65.09,17.14 64.77,17.14 64.45,16.83 63.34,16.83 63.02,16.51 60.96,16.51 60.64,16.19 59.21,16.19 58.74,15.72
  Bottom 0.254: v67.47,18.41 | v67.47,18.41 67.31,18.26 66.2,18.26 65.72,17.78 | 58.74,15.72 58.74,15.22 RGB1.5
N$45  (via drill 0.31 pad 0.3)
  Top 0.254: UCRGB2.22 69.58,14.17 v68.58,13.18
  Bottom 0.16: RGB0.6 54.45,14.64 54.45,14.29 54.61,14.13 55.24,14.13 55.72,13.65 56.99,13.65 57.47,13.18 v68.58,13.18
N$46  (via drill 0.31 pad 0.3)
  Top 0.254: UCRGB2.24 70.48,13.17 69.69,12.38 v69.69,11.91
  Bottom 0.16: 68.42,11.91 67.79,12.54 57.15,12.54 56.67,13.02 55.24,13.02 54.93,13.34 51.91,13.34 51.12,14.13 51.12,14.37 RGB0.4
  Bottom 0.254: 68.42,11.91 v69.69,11.91
N$47  (via drill 0.31 pad 0.3)
  Top 0.254: UCRGB2.23 70.19,13.67 v69.06,12.54
  Bottom 0.16: 68.42,12.54 68.26,12.7 68.1,12.86 57.31,12.86 56.83,13.34 55.4,13.34 55.09,13.65 53.18,13.65 52.7,14.13 52.7,14.58 RGB0.5
  Bottom 0.254: 68.42,12.54 v69.06,12.54
N$48  (via drill 0.31)
  Top 0.254: UCRGB2.10 74.75,18.24 75.56,19.05 v75.88,19.05
  Bottom 0.254: v75.88,19.05 75.88,18.1 78.42,15.56 78.42,15.01 RGB4.6
N$49  (via drill 0.31)
  Top 0.254: UCRGB2.11 74.25,18.69 v75.09,19.53
  Bottom 0.254: v75.09,19.53 75.09,17.62 76.52,16.19 RGB4.5
N$50  (via drill 0.31)
  Top 0.254: UCRGB2.12 73.75,19.46 v74.3,20
  Bottom 0.254: v74.3,20 74.3,16.51 74.61,16.19 74.61,15.01 RGB4.4
N$51  (via drill 0.31)
  Top 0.254: UCRGB2.13 73.25,19.46 v72.71,20
  Bottom 0.254: v72.71,20 72.71,16.51 72.39,16.19 72.39,15.01 RGB3.6
N$52  (via drill 0.31 pad 0.3)
  Top 0.254: UCRGB2.15 72.25,18.24 v71.44,19.05
  Bottom 0.254: v71.44,19.05 71.44,18.1 68.74,15.4 68.74,14.95 RGB3.4
N$53  (via drill 0.31 pad 0.3)
  Top 0.254: UCRGB2.14 72.75,18.85 v72.07,19.53
  Bottom 0.254: v72.07,19.53 72.07,17.3 70.48,15.4 RGB3.5
N$54  (via drill 0.31)
  Top 0.254: UCRGB2.8 76,16.95 v77.47,18.41
  Bottom 0.16: v77.47,18.41 79.38,16.51 79.85,16.51 80.17,16.19 81.76,16.19 82.23,15.72 82.23,15.22 RGB5.5
N$55  (via drill 0.31)
  Top 0.254: UCRGB2.9 75.25,17.78 75.56,18.1 76.2,18.1 v76.52,18.41
  Bottom 0.16: v76.52,18.41 78.74,16.19 79.69,16.19 80.64,15.24 80.64,15.01
  Bottom 0.254: 80.64,15.01 RGB5.4
N$56  (via drill 0.31)
  Top 0.254: UCRGB2.4 77.56,14.67 v79.06,13.18
  Bottom 0.152: v79.06,13.18 89.06,13.18 90.17,14.29 90.49,14.69 RGB6.6
N$57  (via drill 0.31)
  Top 0.254: UCRGB2.5 78.17,15.17 v79.53,13.81
  Bottom 0.152: v79.53,13.81 79.85,13.49 87.79,13.49 88.58,14.29 RGB6.5
N$58  (via drill 0.31)
  Top 0.254: UCRGB2.6 76.63,15.67 v79.38,18.41
  Bottom 0.16: v79.38,18.41 79.38,17.94 80.49,16.83 82.07,16.83 82.39,16.51 83.5,16.51 83.82,16.19 85.72,16.19 86.2,15.72 86.2,15.48 RGB6.4
N$59  (via drill 0.31)
  Top 0.152: 76.05,13.17 76.36,13.17
  Top 0.254: UCRGB2.1 76.05,13.17 | 76.36,13.17 v77.31,12.22
  Bottom 0.152: 79.85,12.06 79.69,11.91 77.63,11.91 v77.31,12.22 | 79.85,12.06 | 79.85,12.06 80.01,12.22 93.19,12.22 | 96.04,14.13 96.04,14.53 RGB7.6
  Bottom 0.16: 93.19,12.22 94.3,13.34 95.25,13.34 96.04,14.13
N$60  (via drill 0.31)
  Top 0.254: UCRGB2.2 76.81,13.67 v77.47,13.02
  Bottom 0.152: 78.42,12.22 79.53,12.22 79.85,12.54 92.87,12.54 94.61,14.29 RGB7.5
  Bottom 0.16: v77.47,13.02 78.26,12.22 78.42,12.22
N$61  (via drill 0.31)
  Top 0.254: UCRGB2.3 77.43,14.17 78.11,13.49 78.11,13.18 v78.26,13.02
  Bottom 0.152: v78.26,13.02 78.74,12.54 79.38,12.54 79.69,12.86 91.12,12.86 92.55,14.29 92.55,14.64 RGB7.4
N$62
  Top 0.254: UCRGB2.27 72.75,11.79 71.28,10.32 R602.2 71.6,9.15
N$63
  Top 0.16: UCACCEL.3 62.17,12.54
  Top 0.254: 62.17,12.54 R901.2
N$64
  Top 0.254: R802.2 76.26,1.53 77.15,0.64 83.19,0.64 84.76,2.21 D1.3
N$65  (via drill 0.31 pad 0.3)
  Top 0.254: UCRGB1.25 22.27,11.79 20,9.53 v20,8.89 | UCRGB2.32 75.25,11.74 77.15,9.84 v77.15,8.89
  Bottom 0.16: v20,8.89 20.32,9.21 76.83,9.21 v77.15,8.89
N$66  (via drill 0.31)
  Top 0.254: v45.09,5.24 46.04,4.29 R801.2
  Bottom 0.254: 48.74,4.72 UCLSEN.P$4 47.99,4.4 47.15,5.24 v45.09,5.24 44.61,5.24 44.13,4.76 42.77,4.76 LEDIR.C 39.93,5.15 39.21,5.87 R803.2
N$67
  Top 0.254: FET1.3 23.18,20.95 22.54,20.32 20.64,20.32 20,19.68 19.42,19.68 R117.1
N$68
  Top 0.254: UCL1.5 56.99,2.86 57.94,3.49 59.75,3.49 R701.2
N$69
  Top 0.16: UCACCEL.8 57.28,15.05
  Top 0.254: 57.28,15.05 57.28,16.35 C904.1
N$70
  Top 0.254: UCL2.5 64.14,1.59 64.45,1.27 65.41,1.27 65.72,1.59 65.72,2.22 66.04,2.54 67.89,2.54 R702.2
N$71
  Top 0.254: BON2.P$1 91.4,23.73 BON.2 91.4,21.95 91.92,21.43 91.92,19.37 91.12,18.57 88.53,18.57 R106.1
N$72  (via drill 0.31)
  Top 0.254: v44.93,2.54 45.88,2.54 C802.1 45.82,1.91 | 51.06,1.53 C803.1 50.96,1.43 v51.91,1.43 | v73.66,1.59 R802.1
  Bottom 0.254: LEDIR.A 42.39,2.54 v44.93,2.54 45.56,2.54 46.83,1.27 51.91,1.27 v51.91,1.43 52.39,1.11 70.33,1.11 70.8,1.59 v73.66,1.59 C804.1
N$73  (via drill 0.31)
  Top 0.254: v55.24,2.22 55.91,2.22 UCL1.4
  Bottom 0.254: v55.24,2.22 56.36,2.22 LEDUV.C
N$74
  Top 0.254: R119.1 31.06,21.11 29.53,21.11 C106.2
N$75
  Top 0.254: R302.1 94.19,8.57 93.98,8.57 93.4,7.99 C304.2
N$76  (via drill 0.31)
  Top 0.254: R805.2 47.36,5.4 v47.94,5.4
  Bottom 0.254: v47.94,5.4 49.05,5.4 49.37,5.08 UCLSEN.P$5
N$77  (via drill 0.31)
  Top 0.254: R14.2 23.87,1.59 v24.77,1.59
  Bottom 0.305: ICSP.3 9.53,4.45 12.06,1.91 24.45,1.91 v24.77,1.59
N$78
  Top 0.305: R13.2 9.63,4.87 8.73,3.97 8.73,3.17 ICSP.1
N$79  (via drill 0.31)
  Top 0.254: UCL2.6 65.08,2.86 64.61,3.33 63.66,3.33 63.18,2.86 63.18,2.54 | 63.18,2.54 UCL2.4 63.06,2.22 | v62.39,2.54 63.18,2.54
  Bottom 0.254: LEDWHITE.K 62.23,2.53 v62.39,2.54
  pour Bottom (isolate 0.2, no thermals): 58.42,2.86 58.42,1.27 61.28,1.27 61.28,2.86
N$80  (via drill 0.31)
  Top 0.254: v21.59,24.13 22.49,24.13 R116.1 | v4.6,17.46 5.56,17.46 5.87,17.14 5.87,16.55 FULL.A CHRG.C | R116.1 22.6,24.13 | v15.56,23.81 14.79,23.81 UCCHRG.1 | R104.2 22.76,23.97 R116.1
  Bottom 0.254: v21.59,24.13 21.59,22.54 19.68,20.64 15.56,20.64 | v4.6,17.46 5.24,17.62 6.03,18.41 9.21,18.41 11.43,20.64 15.56,20.64 | 15.56,20.64 v15.56,23.81
N$81
  Top 0.16: UCRGB2.25 71.75,12.06 70.33,10.64 69.06,10.64 SOUT.TP
N$83  (via drill 0.31)
  Top 0.254: UCRTC.7 73.33,3.96 v73.98,4.6 | v82.71,5.4 82.71,9.53 82.55,9.68 82.55,11.96 R301.2 83.51,13.34 83.51,15.86 83.5,15.88 D2.3
  Bottom 0.254: v73.98,4.6 74.3,4.92 82.23,4.92 v82.71,5.4
N$84
  Top 0.16: 57.78,10.32 UCACCEL.15
  Top 0.254: 57.78,10.32 57.78,9.37 TNC.TP
N$85
  Top 0.254: UCRTC.1 76.7,3.31 77.85,2.16 Y2.1 79.22,2.16 C303.1
N$86
  Top 0.16: UCACCEL.2 60.67,12.04
  Top 0.254: 60.67,12.04 61.44,11.27 62.45,11.27 C901.1
N$87
  Top 0.254: 79.12,3.85 C302.1 78.75,3.56 Y2.2 77.31,3.96 UCRTC.2
NPWREN
  Top 0.16: 85.57,13.3 85.62,13.35 R301.1
  Top 0.254: 87.51,12.4 R111.2 86.95,11.92 FET2.6 | FET2.5 FET2.6 | FET2.6 85.57,13.3 | R301.1 85.62,14.92 D2.1
PWREN  (via drill 0.31)
  Top 0.254: BON2.P$2 BON.1 95.89,22.95 95.89,21.91 95.41,21.43 95.41,18.89 | 95.41,18.89 94.61,18.1 94.61,11.49 R302.2 94.93,10.79 93.08,10.79 R107.1 91.92,10.58 91.76,10.42 | R112.2 87.95,8.79 R113.2 89.75,8.1 90.59,8.1 C104.2 91.76,8.79 91.76,10.42 | 84.77,11.27 FET2.2 | 84.77,11.27 84.77,9.53 85.09,9.21 86.2,9.21 86.84,9.21 87.15,9.21 87.57,8.79 R112.2 | 91.76,10.42 | R112.2 87.63,8.89 | v54.45,23.5 56.67,21.27 60.96,21.27 61.59,21.91 63.18,21.91 63.5,21.59 67.47,21.59 v68.42,20.64 | v35.56,24.61 34.92,25.24 31.59,25.24 30.27,23.91 R110.1 31.38,21.91 31.96,21.91 R119.2 | UCVRG.3 91.12,10.42 91.76,10.42 | 95.41,18.89 | 95.41,18.89 96.25,18.05 BOFF.P$1 | 84.77,11.27 84.77,14.29 84.3,14.76 v84.3,20.32
  Bottom 0.16: v68.42,20.64 68.74,20.95 73.18,20.95 73.5,21.27 83.34,21.27 v84.3,20.32
  Bottom 0.254: v35.56,24.61 37.94,24.61 39.37,23.18 40.32,23.18 41.27,24.13 47.94,24.13 48.9,23.18 49.85,23.18 50.8,24.13 53.82,24.13 v54.45,23.5
PWRGOOD
  Top 0.254: UCVRG.4 91.15,13.02 92.23,13.02 | 92.71,12.33 R107.2 92.23,13.02 | 92.23,13.02 C107.2
RESET  (via drill 0.31)
  Top 0.254: BRESET.P$2 1.48,5.08 3.49,5.08 4.13,5.71 5.56,5.71 7.3,6.99 ICSP.5 | UCATMEL.13 37.69,7.46 37.09,7.46 36.46,6.83 35.56,6.83 33.34,4.6 | 33.34,4.6 33.18,4.6 | 33.34,4.6 33.34,4.34 R2.1 32.65,4.92 v32.01,4.92
  Bottom 0.254: ICSP.5 9.21,6.99 13.65,2.54 25.4,2.54 27.78,4.92 v32.01,4.92
RX_LED
  Top 0.254: UCATMEL.8 33.66,10.75 R4.2
SCK  (via drill 0.31, 0.31 pad 0.3)
  Top 0.254: UCATMEL.9 35.01,10.25 33.02,8.26 v32.86,8.26 | UCRGB2.31 74.75,11.45 76.52,9.68 v76.52,8.26 | UCRGB1.31 26.49,11.13 26.83,10.79 27.94,10.79 29.05,9.68 29.05,8.89 | v29.05,8.26 29.05,8.89 | R202.2 28,8.89 29.05,8.89 | UCEEPROM.6 23.81,2.7 23.65,2.86 R14.1 | R14.1 23.65,3.17 | v24.92,3.97 24.55,3.97 R14.1
  Bottom 0.16: v32.86,8.26 | v32.86,8.26 33.02,8.41 | 33.02,8.41 | 33.02,8.41 33.18,8.57 48.1,8.57 48.74,7.94 49.05,7.94 49.69,8.57 68.74,8.57 69.37,7.94 69.69,7.94 70.48,8.73 76.04,8.73 v76.52,8.26
  Bottom 0.254: v32.86,8.26 v29.05,8.26 27.3,8.26 24.92,5.87 v24.92,3.97
SCL  (via drill 0.31)
  Top 0.16: 61.91,16.83 61.91,17.3 64.61,20 68.74,20 69.85,21.11 JP_PINS.6 | 60.67,13.04 UCACCEL.4
  Top 0.254: UCATMEL.18 40.19,6.01 41.12,5.08 42.86,5.08 43.18,4.76 44.29,4.76 44.93,4.13 v44.93,3.49 | 66.04,6.35 v66.2,6.35 67.63,4.92 70.33,4.92 70.64,4.61 UCRTC.6 | 66.04,6.35 | 64.37,11.03 64.61,10.79 64.61,8.73 65.41,7.94 65.72,7.94 66.04,7.62 66.04,6.35 | 64.37,11.03 63.98,11.43 63.98,12.38 63.18,13.18 63.18,13.34 | 63.18,13.34 60.96,13.34 60.67,13.04 | 61.91,16.83 63.18,15.56 63.18,13.34 | R9.1 64.4,11.06 64.37,11.03
  Bottom 0.16: 51.44,6.19 51.91,6.67 65.88,6.67 v66.2,6.35
  Bottom 0.254: 51.44,6.19 51.44,2.54 50.64,1.75 49.37,1.75 | 49.37,1.75 UCLSEN.P$2 | 49.37,1.75 47.15,1.75 45.4,3.49 v44.93,3.49
SDA  (via drill 0.31)
  Top 0.16: 58.28,15.08 UCACCEL.6 | v62.55,17.14 65.09,19.68 69.06,19.68 72.39,23.02 JP_PINS.5
  Top 0.254: UCATMEL.19 40.69,6.3 41.43,5.56 43.5,5.56 v43.66,5.56 | v60.17,16.99 60.01,16.83 60.01,15.08 58.28,15.08 | v62.55,17.14 63.66,16.03 63.66,13.49 64.29,12.86 65.25,11.91 65.25,9.79 R8.1 66.3,8.79 66.67,8.41 66.67,6.99 v67.15,6.51 67.15,6.19 67.94,5.4 70.64,5.4 70.8,5.24 71.75,5.24 UCRTC.5
  Bottom 0.16: v67.15,6.51 66.67,6.99 51.59,6.99 50.01,5.4 49.55,5.87 50.02,5.4
  Bottom 0.254: v43.66,5.56 44.13,6.03 49.37,6.03 49.61,5.79 50.01,5.4 50.02,5.4 UCLSEN.P$6 | v62.55,17.14 62.39,16.99 v60.17,16.99
TX_LED  (via drill 0.31)
  Top 0.254: UCATMEL.22 42.19,8.14 v42.7,7.62 | v14.13,7.46 13.87,7.72 R6.2
  Bottom 0.16: 33.5,7.14 34.29,7.94 42.39,7.94 v42.7,7.62
  Bottom 0.254: 33.5,7.14 33.34,7.14 28.1,7.14 27.94,6.99 26.99,6.99 25.56,5.56 25.56,3.65 25.08,3.17 16.51,3.17 14.13,5.56 v14.13,7.46
UBAT  (via drill 0.31)
  Top 0.254: 89.09,10.58 UCVRG.1 89.22,10.45 89.22,10.48 | R111.1 87.53,10.48 | C666.1 87.31,13.76 87.31,13.63 | 88.5,13.44 88.42,13.65 88.42,16.77 R106.2 | X2.1 LIPO2.1 6.83,23.97 3.17,23.97 | v81.12,7.96 81.12,7.94 80.8,7.62 80.64,7.62 79.06,6.03 75.56,6.03 74.77,5.24 74.77,4.13 73.95,3.31 73,3.31 72.55,2.86 72.55,2.01 C301.1 71.89,1.83 UCRTC.8
  Top 0.5: 88.5,11.43 88.5,13.44 88.37,13.63 87.31,13.63
  Top 0.61: 89.22,10.48 89.22,11.43 88.5,11.43 | 87.31,13.63 87.31,13.76 | v79.53,9.37 C665.1 | C664.1 96.94,11.01 96.94,12.01 v97,12.06 | R111.1 87.43,10.62 | v85.57,9.84 85.57,10.01 FET2.4 85.61,10.58 R111.1 | R111.1 89.09,10.58 | C663.1 52.39,11.11 v51.59,11.91 | C662.1 19.21,9.11 v19.21,9.84 | C661.1 9.37,10.1 v9.37,10
  Top 0.813: UCCHRG.3 12.86,23.97 12.38,24.45 | 9.47,24.08 9.84,24.45 | 11.11,24.45 C102.2
  Top 0.9: 9.47,24.08 8.73,23.34 LIPO2.1 | 1.59,24.08 2.33,23.34 LIPO1.1
  Top 1.27: LIPO2.1 LIPO1.1 3.33,23.34 X3.1 | 9.84,24.45 11.11,24.45 12.38,24.45
  Top 2.54: 9.47,24.08 3.17,24.08 | 3.17,23.81 3.17,23.97 3.17,24.08 | 1.59,24.08 3.17,24.08
  Bottom 0.254: 79.06,10.5 78.9,10.02 | RGB2.1 RGB2.2 | v81.12,7.96 81.12,10.02 81.6,10.5
  Bottom 0.406: 91.44,10.5 91.6,10.34
  Bottom 0.61: 16.83,10.5 14.76,10.34 | 78.9,10.02 v79.53,9.37 | 96.44,10.48 RGB7.1 97,11.08 v97,12.06 | v85.57,9.84 86.28,10 RGB6.3 | 51.59,10.5 v51.59,11.91 | 47.62,10.5 RGB15.1 | 19.05,10.5 v19.21,9.84 | v9.37,10 9.53,10 9.53,10.5
  Bottom 0.9: RGB8.3 0.95,11.88 0.95,13.02 0.95,19.21 0.95,22.86 1.59,23.5 1.59,24.08 2.33,23.34 LIPO1.1
  Bottom 1.016: RGB8.2 4.13,10.69 | 8.26,10.5 RGB9.3 | RGB9.1 RGB10.3 RGB10.2 16.83,10.5 RGB10.1 19.05,10.5 RGB11.3 RGB11.2 RGB11.1 RGB12.3 | RGB13.3 RGB13.2 RGB13.1 RGB14.3 RGB14.2 RGB14.1 RGB15.3 RGB15.2 | RGB0.1 RGB1.3 RGB1.2 RGB1.1 RGB2.3 RGB2.2 | RGB3.1 RGB4.3 RGB4.2 RGB4.1 79.06,10.5 | RGB5.2 RGB5.1 RGB6.3 RGB6.2 RGB6.1 91.44,10.5 91.6,10.5 RGB7.3 RGB7.2 | 48.26,10.32 48.58,10 49.85,10 50.35,10.5 RGB0.3
  Bottom 1.676: RGB12.2 RGB12.1 | RGB2.1 RGB3.3 RGB3.2 | RGB15.2 47.62,10.5 48.26,10.32 | RGB0.3 51.59,10.5 RGB0.2
  Bottom 2: 8.26,10.5 RGB8.1 | RGB7.2 RGB7.1 RGB6.3 RGB5.2 81.6,10.5 RGB5.3 79.06,10.5 RGB4.3 RGB3.2 | RGB9.3 9.53,10.5 RGB9.2 16.83,10.5 19.05,10.5 RGB12.2 | RGB12.1 RGB15.2 | RGB0.2 RGB2.1
  Bottom 2.54: 1.59,24.08 9.47,24.08
  Bottom 3.4: RGB8.3 RGB8.2 8.26,10.5
UBAT_SWITCHED  (via drill 0.31)
  Top 0.254: v87.95,6.19 R112.1 86.3,7.78 85.41,7.78 84.93,8.26 | 84.88,8.26 R115.1 84.93,8.26 | FET2.3 | v83.98,8.26 84.93,8.26 | 84.93,8.26 | v81.28,6.19 81.28,5.4 81.6,5.08 81.76,5.08 82.07,4.76 82.07,4.55 D1.1 | C304.1 92.77,5.71 v92.39,5.71
  Top 0.3: v83.98,8.26 FET2.3
  Top 0.406: 84.8,8.44 R115.1 84.82,8.26
  Bottom 0.254: LEDUV.A | v87.95,6.19 88.42,5.71 v92.39,5.71 93.82,5.71 94.93,6.83 JP_LTEST.1 | 59.85,5.95 57.15,5.95 LEDUV.A | LEDWHITE.A 59.85,5.95 | 59.85,5.95 62,5.95 63.02,4.92 64.61,4.92 64.93,4.92 65.72,4.13 70.96,4.13 72.71,5.87 80.96,5.87 v81.28,6.19
  Bottom 0.3: v81.28,6.19 81.6,6.51 82.07,6.51 v83.98,8.26
  pour Bottom (no thermals): 58.42,4.45 58.42,6.03 61.28,6.03 61.28,4.45
UC_CHRGSTAT  (via drill 0.31)
  Top 0.254: R104.1 v28.26,23.97 | UCATMEL.40 39.19,20.45 v39.37,20.64
  Bottom 0.254: 33.81,25.24 35.56,23.5 35.56,23.34 38.26,20.64 v39.37,20.64 | 33.81,25.24 | 33.81,25.24 29.53,25.24 v28.26,23.97
UC_IR  (via drill 0.31)
  Top 0.16: R804.2 50.01,9.47 50.01,9.68
  Top 0.254: UCATMEL.31 48.17,13.25 v48.74,13.34 | v49.37,11.11 49.37,10.32 50.01,9.68 50.16,9.53 50.16,7.14 v50.32,6.99
  Bottom 0.16: v50.32,6.99 49.85,6.51 43.81,6.51 43.5,6.19 41.12,6.19 40.48,6.83 36.2,6.83 35.88,6.51 35.88,5.24 36.2,4.92 36.2,4.45 FET3.1
  Bottom 0.254: v48.74,13.34 49.21,12.86 49.21,11.75 49.37,11.59 v49.37,11.11 | v50.32,6.99
UC_PWRMGT
  Top 0.254: UCATMEL.41 38.69,16.14 38.73,16.35 38.73,20.16 36.25,22.64 C105.2 32.02,22.64 R110.2
UC_TCHRG
  Top 0.254: R118.2 27.94,20 | FET1.1 25.55,20.11 R118.2 | R118.2 27.88,20.48 30.16,20.48 30.64,20 33.34,20 33.97,19.37 33.97,15.56 35.28,14.25 UCATMEL.1
ULEDTEST  (via drill 0.31)
  Top 0.254: R705.1 82.45,19.31 82.87,18.89 82.87,17.78 81.76,16.67 81.76,12.86 81.44,12.54 81.44,8.57 82.07,7.94 82.07,5.87 v81.92,5.71 | v81.92,5.71 | v62.39,1.75 62.23,1.91 58.1,1.91 UCL1.6
  Bottom 0.254: v62.39,1.75 62.55,1.59 67.63,1.59 69.53,3.49 71.12,3.49 73.03,5.4 80.17,5.4 81.6,5.4 v81.92,5.71 82.23,6.03 85.57,6.03 86.52,5.08 94.14,5.08 94.93,4.29 JP_LTEST.2
UUSB
  Top 0.254: UCATMEL.7 32.41,11.25 31.43,12.22 31.43,15.08 31.75,15.4 31.75,16.83 32.38,17.46 32.38,18.73 32.07,19.05 29.84,19.05 | 21.27,19.05 20.64,19.05 20,18.41 19.37,18.41 19.05,18.1 13.65,18.1 12.7,19.05 VUSB.TP 12.7,19.15 | 21.27,19.05 29.84,19.05 | C106.1 29.84,19.31 29.84,19.05 | R120.2 21.27,19.31 21.27,19.05 | 10.32,14 10.32,15.03 R103.1
  Top 0.5: XUSB.VBUS 10.32,14 10.32,18.36 C101.2
  Top 1.1: C101.2 12.7,19.15 | UCCHRG.4 12.86,19.37 VUSB.TP
WL_COOL
  pour Bottom (isolate 0.18, rank 2, no thermals): 55.88,6.03 55.88,1.27 67.47,1.27 69.06,3.17 68.74,3.17 68.74,4.13 67.94,4.13 66.36,4.13 62.23,6.03
XLAT  (via drill 0.31 pad 0.3)
  Top 0.254: UCRGB2.26 72.25,11.93 69.53,9.21 v69.53,8.57 | UCRGB1.26 23.99,11.13 23.81,10.95 22.23,10.95 20.8,9.53 v20.8,8.57 | UCATMEL.26 47.51,10.75 48.9,9.21 v48.9,8.57
  Bottom 0.16: v20.8,8.57 21.11,8.89 48.58,8.89 v48.9,8.57 | v48.9,8.57 | v48.9,8.57 49.21,8.89 69.22,8.89 v69.53,8.57
XYZ
  Bottom 0.254: R803.1 34.92,5.61 34.92,3.17 34.77,3.02 FET3.3

## Text on the board
tPlace: invented at | Baby Giraffe | PCB Design
bPlace: Baby Giraffe | Enterprise Solutions | KTHNX to the Arduino Team, Enki, Marius Kintel, Bre Pettis, Zach Smith and Martin Lenz!
tNames: + | + | GND | F4 | SCL | SDA | F7 | F6 | F5 | 3.3V | - | 2013/01/08 | V2.4 | MagicShifter | inspired | CC BY-NC | by happy | by Wizard23 | VBAT | GND | LT | 8MHz | GND | http://magicshifter.net
bNames: 2013/01/08 | V2.4 | MagicShifter | by Philipp Tiefenbacher | CC BY-NC | http://magicshifter.net | RX | TX | GND